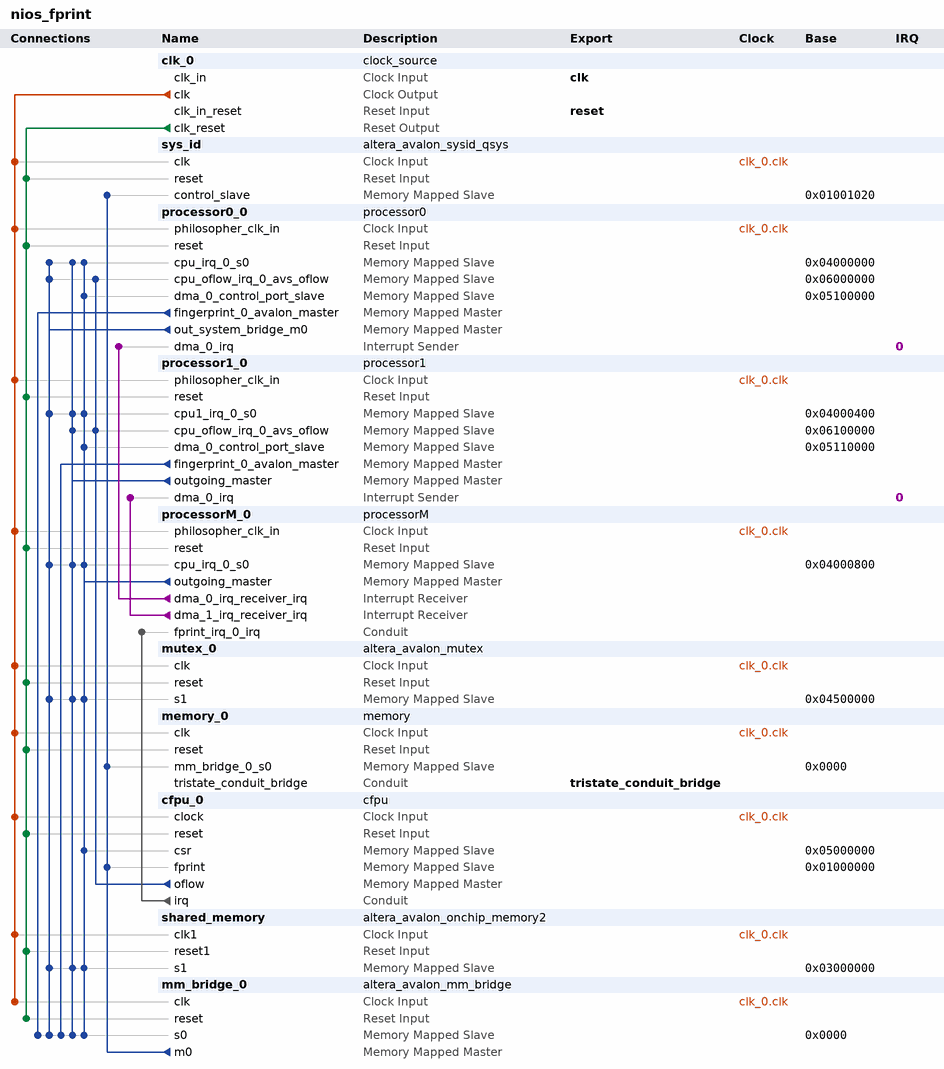
[diagram p0: system contents]
# Platform Designer (Qsys) system nios_fprint, Arria V 5AGXFB3H4F35C5
# Parameters at their usual value, and those the tool derives, are not listed.
package require -exact qsys 13.1
create_system nios_fprint
set_project_property DEVICE_FAMILY {Arria V}
set_project_property DEVICE 5AGXFB3H4F35C5

add_instance clk_0 clock_source 13.1
set_instance_parameter_value clk_0 clockFrequency 50000000

add_instance sys_id altera_avalon_sysid_qsys 13.1
set_instance_parameter_value sys_id id 0

add_instance processor0_0 processor0 1.0

add_instance processor1_0 processor1 1.0

add_instance processorM_0 processorM 1.0

add_instance mutex_0 altera_avalon_mutex 13.1

add_instance memory_0 memory 1.0

add_instance cfpu_0 cfpu 1.0

add_instance shared_memory altera_avalon_onchip_memory2 13.1
set_instance_parameter_value shared_memory dataWidth 32
set_instance_parameter_value shared_memory dualPort false
set_instance_parameter_value shared_memory initMemContent true
set_instance_parameter_value shared_memory initializationFileName onchip_mem.hex
set_instance_parameter_value shared_memory memorySize 1024

add_instance mm_bridge_0 altera_avalon_mm_bridge 13.1
set_instance_parameter_value mm_bridge_0 DATA_WIDTH 32
set_instance_parameter_value mm_bridge_0 ADDRESS_WIDTH 25
set_instance_parameter_value mm_bridge_0 ADDRESS_UNITS SYMBOLS
set_instance_parameter_value mm_bridge_0 MAX_PENDING_RESPONSES 4

# connections
add_connection clk_0.clk cfpu_0.clock clock
add_connection clk_0.clk memory_0.clk clock
add_connection clk_0.clk mm_bridge_0.clk clock
add_connection clk_0.clk mutex_0.clk clock
add_connection clk_0.clk processor0_0.philosopher_clk_in clock
add_connection clk_0.clk processor1_0.philosopher_clk_in clock
add_connection clk_0.clk processorM_0.philosopher_clk_in clock
add_connection clk_0.clk shared_memory.clk1 clock
add_connection clk_0.clk sys_id.clk clock
add_connection clk_0.clk_reset cfpu_0.reset reset
add_connection clk_0.clk_reset memory_0.reset reset
add_connection clk_0.clk_reset mm_bridge_0.reset reset
add_connection clk_0.clk_reset mutex_0.reset reset
add_connection clk_0.clk_reset processor0_0.reset reset
add_connection clk_0.clk_reset processor1_0.reset reset
add_connection clk_0.clk_reset processorM_0.reset reset
add_connection clk_0.clk_reset shared_memory.reset1 reset
add_connection clk_0.clk_reset sys_id.reset reset
add_connection cfpu_0.oflow processor0_0.cpu_oflow_irq_0_avs_oflow avalon
set_connection_parameter_value cfpu_0.oflow/processor0_0.cpu_oflow_irq_0_avs_oflow baseAddress 0x06000000
add_connection cfpu_0.oflow processor1_0.cpu_oflow_irq_0_avs_oflow avalon
set_connection_parameter_value cfpu_0.oflow/processor1_0.cpu_oflow_irq_0_avs_oflow baseAddress 0x06100000
add_connection mm_bridge_0.m0 cfpu_0.fprint avalon
set_connection_parameter_value mm_bridge_0.m0/cfpu_0.fprint baseAddress 0x01000000
add_connection mm_bridge_0.m0 memory_0.mm_bridge_0_s0 avalon
set_connection_parameter_value mm_bridge_0.m0/memory_0.mm_bridge_0_s0 baseAddress 0x0000
add_connection mm_bridge_0.m0 sys_id.control_slave avalon
set_connection_parameter_value mm_bridge_0.m0/sys_id.control_slave baseAddress 0x01001020
add_connection processor0_0.fingerprint_0_avalon_master mm_bridge_0.s0 avalon
set_connection_parameter_value processor0_0.fingerprint_0_avalon_master/mm_bridge_0.s0 baseAddress 0x0000
add_connection processor0_0.out_system_bridge_m0 mm_bridge_0.s0 avalon
set_connection_parameter_value processor0_0.out_system_bridge_m0/mm_bridge_0.s0 baseAddress 0x0000
add_connection processor0_0.out_system_bridge_m0 mutex_0.s1 avalon
set_connection_parameter_value processor0_0.out_system_bridge_m0/mutex_0.s1 baseAddress 0x04500000
add_connection processor0_0.out_system_bridge_m0 processor0_0.cpu_irq_0_s0 avalon
set_connection_parameter_value processor0_0.out_system_bridge_m0/processor0_0.cpu_irq_0_s0 baseAddress 0x04000000
add_connection processor0_0.out_system_bridge_m0 processor0_0.cpu_oflow_irq_0_avs_oflow avalon
set_connection_parameter_value processor0_0.out_system_bridge_m0/processor0_0.cpu_oflow_irq_0_avs_oflow baseAddress 0x06000000
add_connection processor0_0.out_system_bridge_m0 processor1_0.cpu1_irq_0_s0 avalon
set_connection_parameter_value processor0_0.out_system_bridge_m0/processor1_0.cpu1_irq_0_s0 baseAddress 0x04000400
add_connection processor0_0.out_system_bridge_m0 processorM_0.cpu_irq_0_s0 avalon
set_connection_parameter_value processor0_0.out_system_bridge_m0/processorM_0.cpu_irq_0_s0 baseAddress 0x04000800
add_connection processor0_0.out_system_bridge_m0 shared_memory.s1 avalon
set_connection_parameter_value processor0_0.out_system_bridge_m0/shared_memory.s1 baseAddress 0x03000000
add_connection processor1_0.fingerprint_0_avalon_master mm_bridge_0.s0 avalon
set_connection_parameter_value processor1_0.fingerprint_0_avalon_master/mm_bridge_0.s0 baseAddress 0x0000
add_connection processor1_0.outgoing_master mm_bridge_0.s0 avalon
set_connection_parameter_value processor1_0.outgoing_master/mm_bridge_0.s0 baseAddress 0x0000
add_connection processor1_0.outgoing_master mutex_0.s1 avalon
set_connection_parameter_value processor1_0.outgoing_master/mutex_0.s1 baseAddress 0x04500000
add_connection processor1_0.outgoing_master processor0_0.cpu_irq_0_s0 avalon
set_connection_parameter_value processor1_0.outgoing_master/processor0_0.cpu_irq_0_s0 baseAddress 0x04000000
add_connection processor1_0.outgoing_master processor1_0.cpu1_irq_0_s0 avalon
set_connection_parameter_value processor1_0.outgoing_master/processor1_0.cpu1_irq_0_s0 baseAddress 0x04000400
add_connection processor1_0.outgoing_master processor1_0.cpu_oflow_irq_0_avs_oflow avalon
set_connection_parameter_value processor1_0.outgoing_master/processor1_0.cpu_oflow_irq_0_avs_oflow baseAddress 0x06100000
add_connection processor1_0.outgoing_master processorM_0.cpu_irq_0_s0 avalon
set_connection_parameter_value processor1_0.outgoing_master/processorM_0.cpu_irq_0_s0 baseAddress 0x04000800
add_connection processor1_0.outgoing_master shared_memory.s1 avalon
set_connection_parameter_value processor1_0.outgoing_master/shared_memory.s1 baseAddress 0x03000000
add_connection processorM_0.outgoing_master cfpu_0.csr avalon
set_connection_parameter_value processorM_0.outgoing_master/cfpu_0.csr baseAddress 0x05000000
add_connection processorM_0.outgoing_master mm_bridge_0.s0 avalon
set_connection_parameter_value processorM_0.outgoing_master/mm_bridge_0.s0 baseAddress 0x0000
add_connection processorM_0.outgoing_master mutex_0.s1 avalon
set_connection_parameter_value processorM_0.outgoing_master/mutex_0.s1 baseAddress 0x04500000
add_connection processorM_0.outgoing_master processor0_0.cpu_irq_0_s0 avalon
set_connection_parameter_value processorM_0.outgoing_master/processor0_0.cpu_irq_0_s0 baseAddress 0x04000000
add_connection processorM_0.outgoing_master processor0_0.dma_0_control_port_slave avalon
set_connection_parameter_value processorM_0.outgoing_master/processor0_0.dma_0_control_port_slave baseAddress 0x05100000
add_connection processorM_0.outgoing_master processor1_0.cpu1_irq_0_s0 avalon
set_connection_parameter_value processorM_0.outgoing_master/processor1_0.cpu1_irq_0_s0 baseAddress 0x04000400
add_connection processorM_0.outgoing_master processor1_0.dma_0_control_port_slave avalon
set_connection_parameter_value processorM_0.outgoing_master/processor1_0.dma_0_control_port_slave baseAddress 0x05110000
add_connection processorM_0.outgoing_master processorM_0.cpu_irq_0_s0 avalon
set_connection_parameter_value processorM_0.outgoing_master/processorM_0.cpu_irq_0_s0 baseAddress 0x04000800
add_connection processorM_0.outgoing_master shared_memory.s1 avalon
set_connection_parameter_value processorM_0.outgoing_master/shared_memory.s1 baseAddress 0x03000000
add_connection cfpu_0.irq processorM_0.fprint_irq_0_irq conduit
add_connection processorM_0.dma_0_irq_receiver_irq processor0_0.dma_0_irq interrupt
set_connection_parameter_value processorM_0.dma_0_irq_receiver_irq/processor0_0.dma_0_irq irqNumber 0
add_connection processorM_0.dma_1_irq_receiver_irq processor1_0.dma_0_irq interrupt
set_connection_parameter_value processorM_0.dma_1_irq_receiver_irq/processor1_0.dma_0_irq irqNumber 0

# exported interfaces
add_interface clk clock sink
set_interface_property clk EXPORT_OF clk_0.clk_in
add_interface reset reset sink
set_interface_property reset EXPORT_OF clk_0.clk_in_reset
add_interface tristate_conduit_bridge conduit end
set_interface_property tristate_conduit_bridge EXPORT_OF memory_0.tristate_conduit_bridge

set_interconnect_requirement {$system} qsys_mm.clockCrossingAdapter HANDSHAKE
set_interconnect_requirement {$system} qsys_mm.maxAdditionalLatency 1

save_system nios_fprint.qsys
